# Altium schematic sheet nRF24LU1+ Reference Schematic_rev1_0.SchDoc: nRF24LU1+ Reference Layout
size A4; DrawnBy: Endre Rindalsholt; Revision: 1.0; SheetNumber: 1; SheetTotal: 1; ProjectNumber: 4359
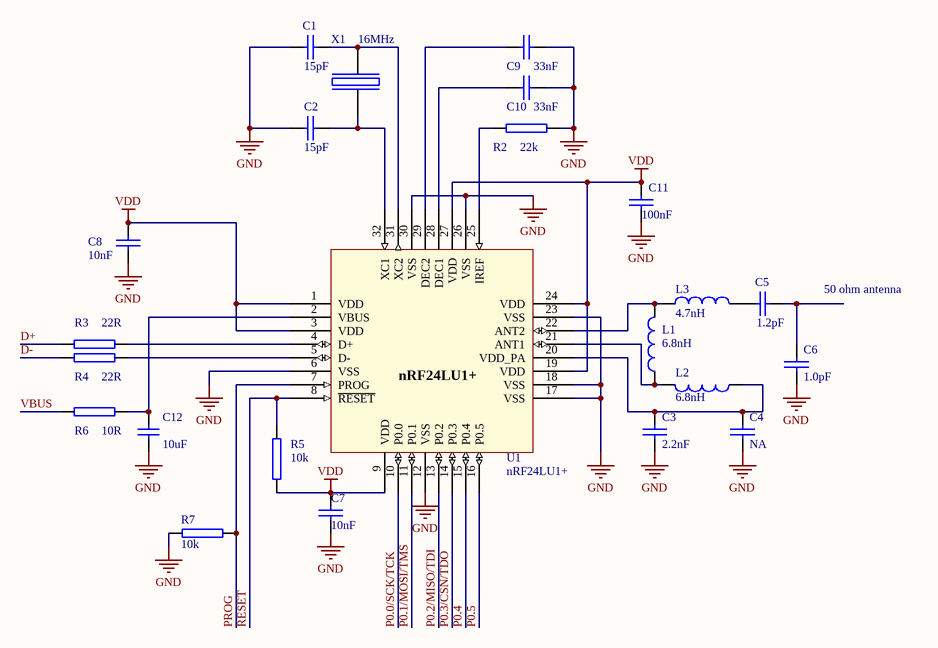
[diagram p0: nRF24LU1+ Reference Schematic_rev1_0.SchDoc]

## Parts
C1  value 15pF  [0402s]  (hidden comment: NPO, +/-2% 50V)
C2  value 15pF  [0402s]  (hidden comment: NPO, +/-2% 50V)
C3  value 2.2nF  [0402s]  (hidden comment: X7R 16V)
C4  value NA  [0402s]  (hidden comment: NP0 50V)
C5  value 1.2pF  [0402s]  (hidden comment: NP0 +/-0.1pF, 50V)
C6  value 1.0pF  [0402s]  (hidden comment: NP0 +/-0.1pF, 50V)
C7  value 10nF  [0402s]  (hidden comment: X7R, +/-10% 50V)
C8  value 10nF  [0402s]  (hidden comment: X7R, +/-10% 50V)
C9  value 33nF  [0402s]  (hidden comment: X7R, +/-10% 50V)
C10  value 33nF  [0402s]  (hidden comment: X7R, +/-10% 50V)
C11  value 100nF  [0402s]  (hidden comment: X7R, +/-10% 50V)
C12  value 10uF  [0805]  (hidden comment: X5R +/-10%, 6.3v)
L1  value 6.8nH  [0402s]  (hidden comment: Murata LQP15MN6N8B02D)
L2  value 6.8nH  [0402s]  (hidden comment: Murata LQP15MN6N8B02D)
L3  value 4.7nH  [0402s]  (hidden comment: Murata LQP15MN4N7B02D)
R2  value 22k  [0402s]  (hidden comment: 1%)
R3  value 22R  [0402s]  (hidden comment: 5%)
R4  value 22R  [0402s]  (hidden comment: 5%)
R5  value 10k  [0402s]  (hidden comment: 5%)
R6  value 10R  [0402s]  (hidden comment: 5%)
R7  value 10k  [0402s]  (hidden comment: 5%)
U1  nRF24LU1+  [QFN32L/5x5]
X1  value 16MHz  [bt-xtal 3225]  (hidden comment: TSX-3225, 16MHz, Cl=9pF, +/-10ppm)

## Nets
GND: C1.2 C2.1 C3.1 C4.1 C6.2 C7.2 C8.2 C9.2 C10.2 C11.2 C12.2 R2.1 R7.1 U1.6(VSS) U1.12(VSS) U1.17(VSS) U1.18(VSS) U1.23(VSS) U1.26(VSS) U1.30(VSS) X1.2(GND) X1.4(GND)
VDD: C7.1 C8.1 C11.1 R5.2 U1.1(VDD) U1.3(VDD) U1.9(VDD) U1.19(VDD) U1.24(VDD) U1.27(VDD)
D+: R3.2
D-: R4.2
P0.0/SCK/TCK: U1.10(P0.0)
P0.1/MOSI/TMS: U1.11(P0.1)
P0.2/MISO/TDI: U1.13(P0.2)
P0.3/CSN/TDO: U1.14(P0.3)
P0.4: U1.15(P0.4)
P0.5: U1.16(P0.5)
PROG: R7.2 U1.7(PROG)
RESET: R5.1 U1.8(~{RESET})
VBUS: R6.2
NetC1_1: C1.1 U1.31(XC2) X1.3(out)
NetC2_2: C2.2 U1.32(XC1) X1.1(inp)
NetC3_2: C3.2 C4.2 L2.1 U1.20(VDD_PA)
NetC5_1: C5.1 C6.1
NetC5_2: C5.2 L3.2
NetC9_1: C9.1 U1.29(DEC2)
NetC10_1: C10.1 U1.28(DEC1)
NetC12_1: C12.1 R6.1 U1.2(VBUS)
NetL1_1: L1.1 L2.2 U1.21(ANT1)
NetL1_2: L1.2 L3.1 U1.22(ANT2)
NetR2_2: R2.2 U1.25(IREF)
NetR3_1: R3.1 U1.4(D+)
NetR4_1: R4.1 U1.5(D-)

## Notes on the sheet
- 50 ohm antenna
- Title
- Size
- Date:
- Project Number
- Sheet         of
- Revision
- File:
- Drawn By:

## Library data of the parts
C1 C2 C7-C11 = CAP: Capacitor; Part Field 1: 0402
C3-C6 = Cap: Capacitor; Part Field 1: 0402
C12 = Cap: Capacitor; Published: 8-Jun-2000; LatestRevisionDate: 17-Jul-2002; LatestRevisionNote: Re-released for DXP Platform.; PackageReference: RAD-0.3; Publisher: Altium Limited
L1-L3 = Inductor: Code_IEC: 1005; Published: 8-Jun-2000; LatestRevisionDate: 17-Jul-2002; LatestRevisionNote: Re-released for DXP Platform.; PackageReference: 0402-A; Publisher: Altium Limited; Code_JEITA: 0402
R2 R4 = RES2: Resistor; Part Field 1: 1608[0603]
R3 = RES2: Resistor; Part Field 1: 0603s
R5 R7 = RES2: Resistor; Part Field 1: 0402
R6 = RES2: Part Field 1: 0402
U1 = nRF24LU1P: 2.4GHz Transceiver with USB
X1 = BT-XTAL: Crystal